# Altium schematic sheet esp32_mcu.SchDoc: ESP32-WROOM-32D MCU
size A4; SheetNumber: 6; SheetTotal: 20; TitleBig: ESP32-WROOM-32D MCU, Wi-Fi + Bluetooth module; Desc_line1: This module integrates an ESP32-D0WD chip, a 240 MHz, dual-core processor with Wi-Fi and Bluetooth capabilities.; Desc_line2: This sheet describes its hardware configuration and I/O pins
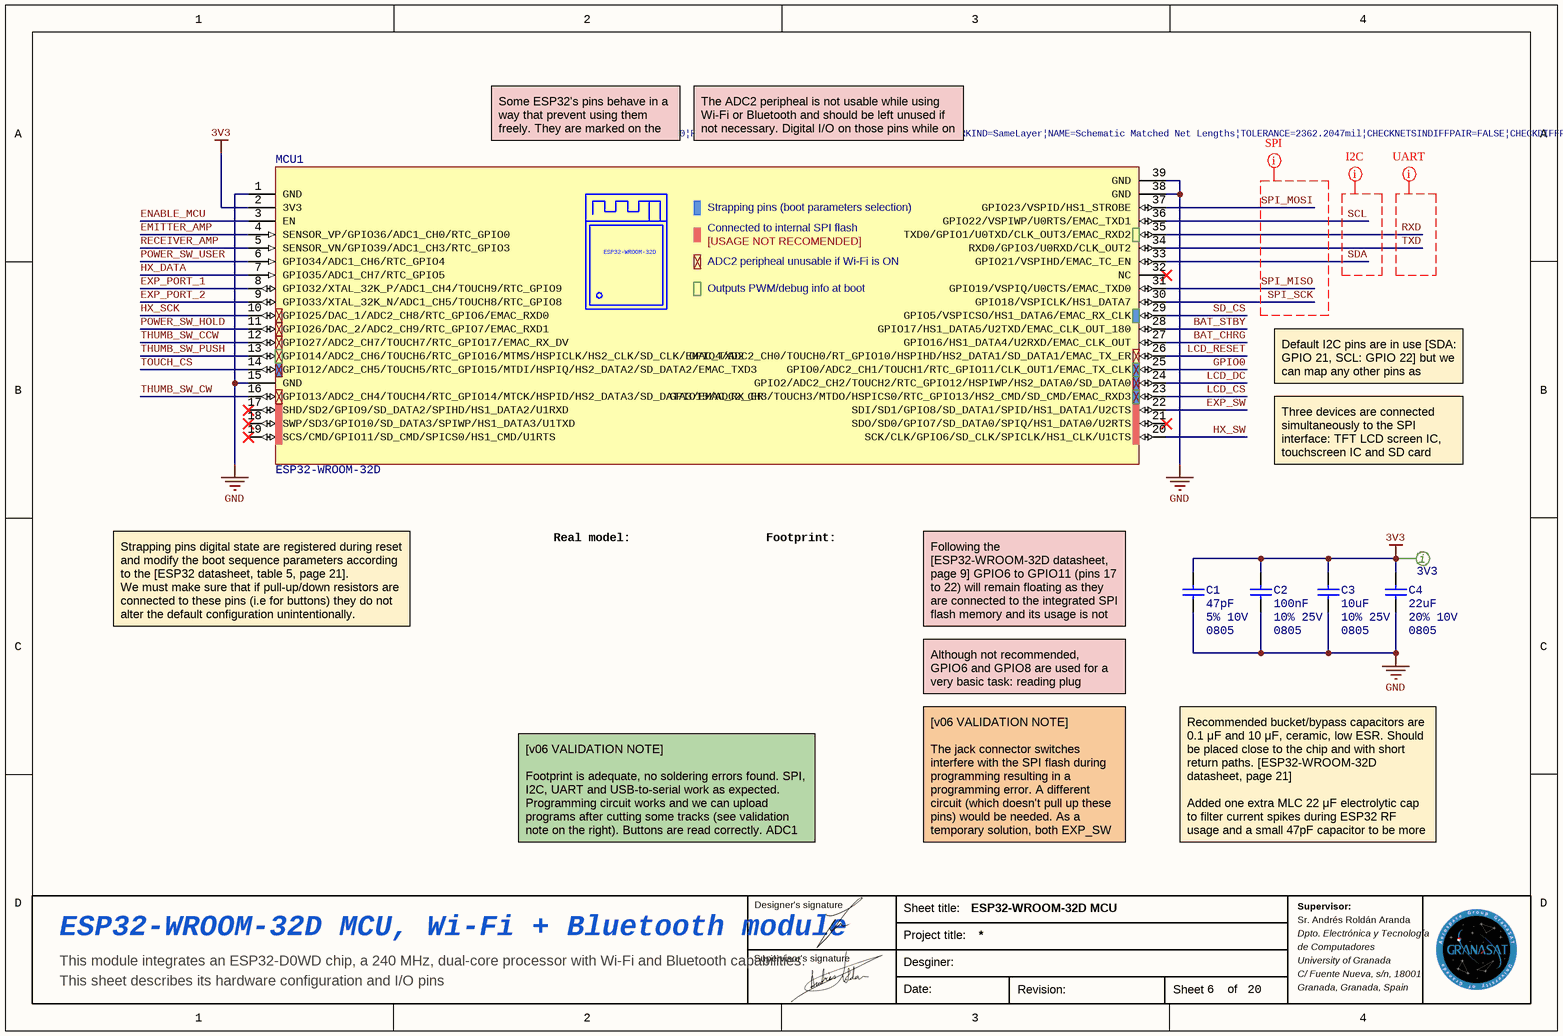
[diagram p0: esp32_mcu.SchDoc]

## Parts
3V3  Test Point Pad dual sided  [TEST POINT PAD]  (value not drawn)  (no BOM)
C1  value 47pF  Tolerance: 5% 10V  PackageDescription: 0805  [CAP 0805_2012]  (hidden comment: Cap_cer_0805)
C2  value 100nF  Tolerance: 10% 25V  PackageDescription: 0805  [CAP 0805_2012]  (hidden comment: Cap_cer_0805)
C3  value 10uF  Tolerance: 10% 25V  PackageDescription: 0805  [CAP 0805_2012]  (hidden comment: Cap_cer_0805)
C4  value 22uF  Tolerance: 20% 10V  PackageDescription: 0805  [CAP 0805_2012]  (hidden comment: Cap_cer_0805)
MCU1  Part: ESP32-WROOM-32D  [MODULE_ESP32-WROOM-32]  (hidden comment: MCU ESP32-WROOM-32D)

## Nets
3V3: 3V3.1 C1.2 C2.2 C3.2 C4.2 MCU1.2(3V3)
GND: C1.1 C2.1 C3.1 C4.1 MCU1.1(GND) MCU1.15(GND) MCU1.38(GND) MCU1.39(GND)
BAT_CHRG: MCU1.27(GPIO16/HS1_DATA4/U2RXD/EMAC_CLK_OUT)
BAT_STBY: MCU1.28(GPIO17/HS1_DATA5/U2TXD/EMAC_CLK_OUT_180)
EMITTER_AMP: MCU1.4(SENSOR_VP/GPIO36/ADC1_CH0/RTC_GPIO0)
ENABLE_MCU: MCU1.3(EN)
EXP_PORT_1: MCU1.8(GPIO32/XTAL_32K_P/ADC1_CH4/TOUCH9/RTC_GPIO9)
EXP_PORT_2: MCU1.9(GPIO33/XTAL_32K_N/ADC1_CH5/TOUCH8/RTC_GPIO8)
EXP_SW: MCU1.22(SDI/SD1/GPIO8/SD_DATA1/SPID/HS1_DATA1/U2CTS)
GPIO0: MCU1.25(GPIO0/ADC2_CH1/TOUCH1/RTC_GPIO11/CLK_OUT1/EMAC_TX_CLK)
HX_DATA: MCU1.7(GPIO35/ADC1_CH7/RTC_GPIO5)
HX_SCK: MCU1.10(GPIO25/DAC_1/ADC2_CH8/RTC_GPIO6/EMAC_RXD0)
HX_SW: MCU1.20(SCK/CLK/GPIO6/SD_CLK/SPICLK/HS1_CLK/U1CTS)
LCD_CS: MCU1.23(GPIO15/ADC2_CH3/TOUCH3/MTDO/HSPICS0/RTC_GPIO13/HS2_CMD/SD_CMD/EMAC_RXD3)
LCD_DC: MCU1.24(GPIO2/ADC2_CH2/TOUCH2/RTC_GPIO12/HSPIWP/HS2_DATA0/SD_DATA0)
LCD_RESET: MCU1.26(GPIO4/ADC2_CH0/TOUCH0/RT_GPIO10/HSPIHD/HS2_DATA1/SD_DATA1/EMAC_TX_ER)
POWER_SW_HOLD: MCU1.11(GPIO26/DAC_2/ADC2_CH9/RTC_GPIO7/EMAC_RXD1)
POWER_SW_USER: MCU1.6(GPIO34/ADC1_CH6/RTC_GPIO4)
RECEIVER_AMP: MCU1.5(SENSOR_VN/GPIO39/ADC1_CH3/RTC_GPIO3)
RXD: MCU1.35(TXD0/GPIO1/U0TXD/CLK_OUT3/EMAC_RXD2)
SCL: MCU1.36(GPIO22/VSPIWP/U0RTS/EMAC_TXD1)
SD_CS: MCU1.29(GPIO5/VSPICSO/HS1_DATA6/EMAC_RX_CLK)
SDA: MCU1.33(GPIO21/VSPIHD/EMAC_TC_EN)
SPI_MISO: MCU1.31(GPIO19/VSPIQ/U0CTS/EMAC_TXD0)
SPI_MOSI: MCU1.37(GPIO23/VSPID/HS1_STROBE)
SPI_SCK: MCU1.30(GPIO18/VSPICLK/HS1_DATA7)
THUMB_SW_CCW: MCU1.12(GPIO27/ADC2_CH7/TOUCH7/RTC_GPIO17/EMAC_RX_DV)
THUMB_SW_CW: MCU1.16(GPIO13/ADC2_CH4/TOUCH4/RTC_GPIO14/MTCK/HSPID/HS2_DATA3/SD_DATA3/EMAC_RX_ER)
THUMB_SW_PUSH: MCU1.13(GPIO14/ADC2_CH6/TOUCH6/RTC_GPIO16/MTMS/HSPICLK/HS2_CLK/SD_CLK/EMAC_TXD2)
TOUCH_CS: MCU1.14(GPIO12/ADC2_CH5/TOUCH5/RTC_GPIO15/MTDI/HSPIQ/HS2_DATA2/SD_DATA2/EMAC_TXD3)
TXD: MCU1.34(RXD0/GPIO3/U0RXD/CLK_OUT2)

Not connected (* = marked no-connect by the designer): MCU1 17(SHD/SD2/GPIO9/SD_DATA2/SPIHD/HS1_DATA2/U1RXD)* 18(SWP/SD3/GPIO10/SD_DATA3/SPIWP/HS1_DATA3/U1TXD)* 19(SCS/CMD/GPIO11/SD_CMD/SPICS0/HS1_CMD/U1RTS)* 21(SDO/SD0/GPIO7/SD_DATA0/SPIQ/HS1_DATA0/U2RTS)* 32(NC)*

## Layout directives
net class I2C; rule Matched Net Lengths [Tolerance = 100mm]: SCL, SDA
net class UART; rule Matched Net Lengths [Tolerance = 100mm]: RXD, TXD
net class SPI; rule Matched Net Lengths [Tolerance = 60mm]: SPI_MISO, SPI_MOSI, SPI_SCK

## Notes on the sheet
- (near MCU1) Some ESP32's pins behave in a way that prevent using them freely. They are marked on the legend below.
- (near MCU1) The ADC2 peripheal is not usable while using Wi-Fi or Bluetooth and should be left unused if not necessary. Digital I/O on those pins while on Wi-Fi or BT is fine.
- Default I2C pins are in use [SDA: GPIO 21, SCL: GPIO 22] but we can map any other pins as hardware I2C.
- Three devices are connected simultaneously to the SPI interface: TFT LCD screen IC, touchscreen IC and SD card reader.
- Real model:
- Footprint:
- Strapping pins digital state are registered during reset and modify the boot sequence parameters according to the [ESP32 datasheet, table 5, page 21].
  We must make sure that if pull-up/down resistors are connected to these pins (i.e for buttons) they do not alter the default configuration unintentionally.
- Following the [ESP32-WROOM-32D datasheet, page 9] GPIO6 to GPIO11 (pins 17 to 22) will remain floating as they are connected to the integrated SPI flash memory and its usage is not recommended for other uses.
- Although not recommended, GPIO6 and GPIO8 are used for a very basic task: reading plug switches.
- [v06 VALIDATION NOTE]
  Footprint is adequate, no soldering errors found. SPI, I2C, UART and USB-to-serial work as expected. Programming circuit works and we can upload programs after cutting some tracks (see validation note on the right). Buttons are read correctly. ADC1 can register analog signals correctly.
- [v06 VALIDATION NOTE]
  The jack connector switches interfere with the SPI flash during programming resulting in a programming error. A different circuit (which doesn't pull up these pins) would be needed. As a temporary solution, both EXP_SW and HX_SW tracks were cut in the PCB.
- Recommended bucket/bypass capacitors are 0.1 μF and 10 μF, ceramic, low ESR. Should be placed close to the chip and with short return paths. [ESP32-WROOM-32D datasheet, page 21]
  Added one extra MLC 22 μF electrolytic cap to filter current spikes during ESP32 RF usage and a small 47pF capacitor to be more effective filtering high frequencies
- Designer's signature
- Sheet title:
- Sr. Andrés Roldán Aranda
- Supervisor:
- Supervisor's signature
- Project title:
- Desginer:
- Dpto. Electrónica y Tecnología
- de Computadores
- University of Granada
- C/ Fuente Nueva, s/n, 18001
- Granada, Granada, Spain
- Date:
- Revision:
- Sheet
- of
- (in symbol MCU ESP32-WROOM-32D) Strapping pins (boot parameters selection); Connected to internal SPI flash; [USAGE NOT RECOMENDED]; ADC2 peripheal unusable if Wi-Fi is ON; Outputs PWM/debug info at boot
- (in symbol Test Point Pad dual sided) i

## Library data of the parts
3V3 = Test Point Pad dual sided: Test point - PCB Pad dual sided
C1 = Cap_cer_0805_47pF_5%: Ceramic cap size 0805; FabGroup: Microcontroller; FabOrder: 1
C2 = Cap_cer_0805_100nF_10%: Ceramic cap size 0805; FabGroup: Microcontroller; FabOrder: 1
C3 = Cap_cer_0805_10uF_10%: Ceramic cap size 0805; FabGroup: Microcontroller; FabOrder: 1
C4 = Cap_cer_0805_22uF_20%: Ceramic cap size 0805 CC0805MKX5R6BB226 Yageo MLCC 22uF 10V 20% X5R
MCU1 = MCU ESP32-WROOM-32D: - Transceiver; 802.11 b/g/n _Wi-Fi, WiFi, WLAN_, Bluetooth Smart Ready 4.x Dual Mode For Use With ESP-WROOM-32; MF: Espressif Systems; FabGroup: Microcontroller; FabOrder: 1; Package: None; Price: None; Availability: Unavailable; MP: ESP32-WROOM-32D; SnapEDA_Link: https://www.snapeda.com/parts/ESP32-DEVKITC-32D/Espressif%20Systems/view-part/2777395/?ref=snap; Value: *